# Altium project AnalogECG.PrjPcb
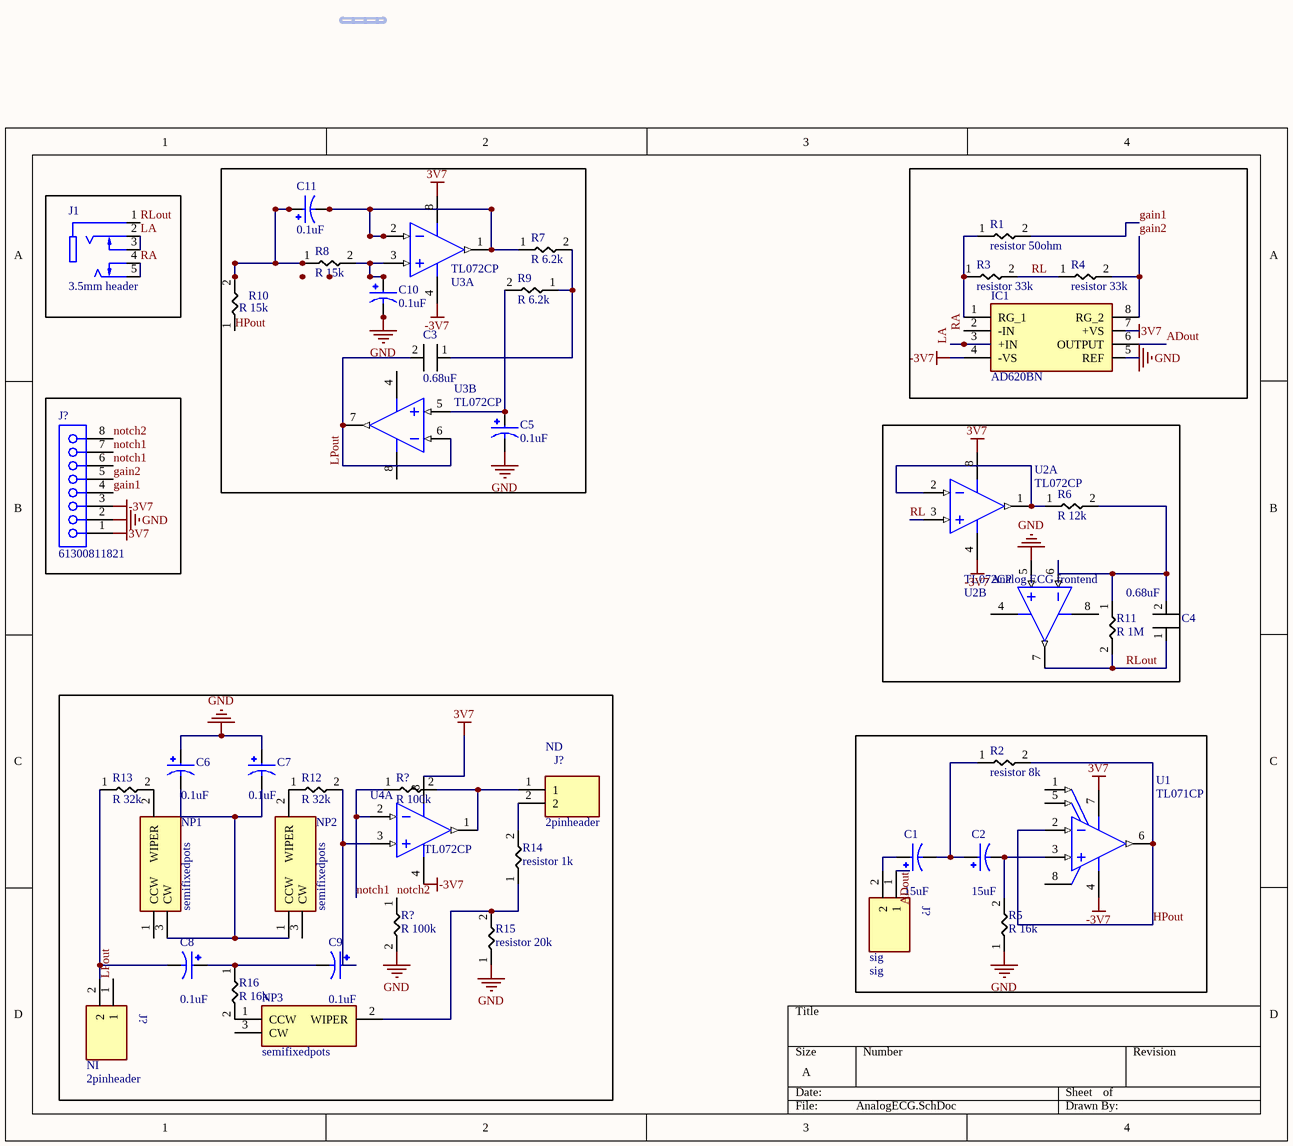
[diagram p0: AnalogECG.SchDoc]
1 sheet, 42 parts. Net scope: global (net labels, ports and power ports of the same name join across sheets).
Board file: analog_ECG_PCB_v1.PcbDoc

## Sheet AnalogECG.SchDoc
size A; SheetNumber: 1; SheetTotal: 1

### Parts
(Parts that share a designator on the sheet are numbered #1, #2 ... from top to bottom, then left to right.)
C1  value 15uF  [Capacitor10uF]  (hidden comment: capacitor 15uF)
C2  value 15uF  [Capacitor10uF]  (hidden comment: capacitor 15uF)
C3  0.68uF  [Capacitor - duplicate]
C4  0.68uF  [Capacitor - duplicate]
C5  value 0.1uF  [Capacitor10uF]  (hidden comment: capacitor 0.1uF)
C6  0.1uF  [Capacitor10uF]
C7  0.1uF  [Capacitor10uF]
C8  value 0.1uF  [Capacitor10uF]  (hidden comment: capacitor 0.1uF)
C9  value 0.1uF  [Capacitor10uF]  (hidden comment: capacitor 0.1uF)
C10  0.1uF  [Capacitor10uF]
C11  0.1uF  [Capacitor10uF]
IC1  AD620BN  [DIP794W56P254L959H533Q8N]
J1  3.5mm header  [SWITCHCRAFT_35RAPC4BH3]
J?  61300811821  [61300811821]
ND  2pinheader  [HDRV2W66P0X254_1X2_508X254X874P]
NI  2pinheader  [HDRV2W66P0X254_1X2_508X254X874P]
NP1  semifixedpots  [VRRM065]
NP2  semifixedpots  [VRRM065]
NP3  semifixedpots  [VRRM065]
R1  resistor 50ohm  [Axial 0.4]
R2  resistor 8k  [Axial 0.4]
R3  resistor 33k  [Axial 0.4]
R4  resistor 33k  [Axial 0.4]
R5  R 16k  [Axial 0.4]
R6  R 12k  [Axial 0.4]
R7  R 6.2k  [Axial 0.4]
R8  R 15k  [Axial 0.4]
R9  R 6.2k  [Axial 0.4]
R10  R 15k  [Axial 0.4]
R11  R 1M  [Axial 0.4]
R12  R 32k  [Axial 0.4]
R13  R 32k  [Axial 0.4]
R14  resistor 1k  [Axial 0.4]
R15  resistor 20k  [Axial 0.4]
R16  R 16k  [Axial 0.4]
R?#1  R 100k  [Axial 0.4]
R?#2  R 100k  [Axial 0.4]
sig  sig  [HDRV2W66P0X254_1X2_508X254X874P]
U1  TL071CP  [P0008A]
U2  TL072CP  [P0008A]  (parts A,B of 2)
U3  TL072CP  [P0008A]  (parts A,B of 2)
U4  TL072CP  [P0008A]  (part A of 2)

### Blocks framed on the sheet
Analog ECG frontend: C4 R6 R11 U2

### Nets
3V7: IC1.7(+VS) J?.1 U1.7(VCC+) U2.8(VCC+) U3.8(VCC+) U4.8(VCC+)
-3V7: IC1.4(-VS) J?.3 U1.4(VCC-) U2.4(VCC-) U3.4(VCC-) U4.4(VCC-)
GND: C5.N C6.P C7.P C10.N IC1.5(REF) J?.2 R5.1 R15.1 R?#2.2 U2.5(IN2+)
ADout: IC1.6(OUTPUT) sig.1
gain1: J?.4 R1.2
gain2: IC1.8(RG_2) J?.5 R4.2
HPout: R2.2 R10.1 U1.2(IN-) U1.6(OUT)
LA: IC1.3(+IN) J1.2 J1.3
LPout: C3.2 NI.1 U3.6(IN2-) U3.7(OUT2)
notch1: J?.6 J?.7 R?#1.1 U4.2(IN1-)
notch2: J?.8 R?#2.1
RA: IC1.2(-IN) J1.4 J1.5
RL: R3.2 R4.1 U2.3(IN1+)
RLout: C4.1 J1.1 R11.2 U2.7(OUT2)
NetC1_N: C1.N C2.P R2.1
NetC1_P: C1.P sig.2
NetC2_N: C2.N R5.2 U1.3(IN+)
NetC3_1: C3.1 R7.2 R9.1
NetC4_2: C4.2 R6.2 R11.1 U2.6(IN2-)
NetC5_P: C5.P R9.2 U3.5(IN2+)
NetC6_N: C6.N C7.N NP1.3(CW) NP2.1(CCW)
NetC8_N: C8.N NI.2 R13.1
NetC8_P: C8.P C9.N R16.1
NetC9_P: C9.P R12.2 U4.3(IN1+)
NetC10_P: C10.P R8.2 U3.3(IN1+)
NetC11_N: C11.N R7.1 U3.1(OUT1) U3.2(IN1-)
NetC11_P: C11.P R8.1 R10.2
NetIC1_1: IC1.1(RG_1) R1.1 R3.1
NetND_1: ND.1 R?#1.2 U4.1(OUT1)
NetND_2: ND.2 R14.2
NetNP1_2: NP1.2(WIPER) R13.2
NetNP2_2: NP2.2(WIPER) R12.1
NetNP3_1: NP3.1(CCW) R16.2
NetNP3_2: NP3.2(WIPER) R14.1 R15.2
NetR6_1: R6.1 U2.1(OUT1) U2.2(IN1-)

Not connected (* = marked no-connect by the designer): NP1 1(CCW); NP2 3(CW); NP3 3(CW); U1 1(OFFSET_N1) 5(OFFSET_N2) 8(NC)

### Notes on the sheet
- (in symbol 2pinheader) J?

### Library data of the parts
C1 C2 = ECA-1HM100I (2): Aluminum Electrolytic Capacitor, Polarized, Aluminum (wet), 50V, 20% +Tol, 20% -Tol, 10uF, Through Hole Mount; Manufacturer: Panasonic; Dielectric Material: Aluminium; Leakage Current: 5uA; Ripple Current: 65mA; Tan Delta: 0.12; Supplier: Mouser; Supplier Part Number: 667-ECA-1HM100I; Manufacturer Part Number: ECA-1HM100I; RoHS: Yes; Category: Aluminum Electrolytic Capacitors; Stock: 35307; Pricing: 1=0.28, 10=0.193, 50=0.116, 100=0.098, 400=0.06, 1000=0.06, 2000=0.056, 4000=0.051, 8000=0.048, 10000=0.048 (USD); Mounting Technology: Through Hole; Pins: 2; Package Shape: Cylindrical; Terminal Finish: Tin; Min Operating Temperature: -40°C; Max Operating Temperature: 85°C; JESD-609 Code: e3; Package Style: RadialMeter; Packaging: Tape and Reel; Termination: Wire; Polarity: Polarized; Capacitor Type: Aluminium; Tolerance  (fill in as +-): 20%; Tolerance (fill in as +-): 20%; Rated DC Voltage (URdc): 50V; Diameter: 5mm; Length: 11mm; Terminal Pitch: 2.5mm; Reach SVHC Compliant: Yes; RoHS Compliant: Yes; ComponentLink1URL: https://datasheet.ciiva.com:443/pdfs/VipMasterIC/IC/PANA/PANA-S-A0009891632/PANA-S-A0009891632-1.pdf?src-supplier=IHS+Markit; ComponentLink1Description: https://datasheet.ciiva.com:443/pdfs/VipMasterIC/IC/PANA/PANA-S-A0009891632/PANA-S-A0009891632-1.pdf?src-supplier=IHS+Markit; ComponentLink2URL: https://datasheet.ciiva.com/14608/70067785-14608821.pdf?src-supplier=Allied+Electronics; ComponentLink2Description: https://datasheet.ciiva.com/14608/70067785-14608821.pdf?src-supplier=Allied+Electronics; ComponentLink3URL: https://datasheet.ciiva.com/15197/getdatasheetpartid-238364-15197946.pdf?src-supplier=Verical; ComponentLink3Description: https://datasheet.ciiva.com/15197/getdatasheetpartid-238364-15197946.pdf?src-supplier=Verical; ComponentLink4URL: https://datasheet.ciiva.com/7794/1907780-7794379.pdf?src-supplier=Element14; ComponentLink4Description: https://datasheet.ciiva.com/7794/1907780-7794379.pdf?src-supplier=Element14; ComponentLink5URL: https://datasheet.ciiva.com/2984/aba0000ce12-2984335.pdf?src-supplier=Avnet; ComponentLink5Description: https://datasheet.ciiva.com/2984/aba0000ce12-2984335.pdf?src-supplier=Avnet; ComponentLink6URL: https://datasheet.ciiva.com/6121/aba0000ce12-6121535.pdf?src-supplier=Farnell; ComponentLink6Description: https://datasheet.ciiva.com/6121/aba0000ce12-6121535.pdf?src-supplier=Farnell; ComponentLink7URL: https://datasheet.ciiva.com/28677/aba0000ce12-28677830.pdf?src-supplier=Element14; ComponentLink7Description: https://datasheet.ciiva.com/28677/aba0000ce12-28677830.pdf?src-supplier=Element14; ComponentLink8URL: https://datasheet.ciiva.com/24234/aba0000ce12-465472-24234949.pdf?src-supplier=Mouser; ComponentLink8Description: https://datasheet.ciiva.com/24234/aba0000ce12-465472-24234949.pdf?src-supplier=Mouser
C3 C4 = DE21XSA220KN3AX02F: Ceramic Capacitor, Ceramic, 10% +Tol, 10% -Tol, SL, -1000/+350ppm/Cel TC, 0.000022uF, Through Hole Mount; Manufacturer: Murata; Supplier: Mouser; Supplier Part Number: 81-DE21XSA220KN3AX2F; Manufacturer Part Number: DE21XSA220KN3AX02F; RoHS: Yes; Category: Ceramic Capacitors; Stock: 156; Pricing: 1=0.38, 10=0.252, 50=0.252, 100=0.151, 1000=0.095, 10000=0.09 (USD)
C5-C11 = ECA-1HM100I (2)_1: Aluminum Electrolytic Capacitor, Polarized, Aluminum (wet), 50V, 20% +Tol, 20% -Tol, 10uF, Through Hole Mount; Manufacturer: Panasonic; Dielectric Material: Aluminium; Leakage Current: 5uA; Ripple Current: 65mA; Tan Delta: 0.12; Supplier: Mouser; Supplier Part Number: 667-ECA-1HM100I; Manufacturer Part Number: ECA-1HM100I; RoHS: Yes; Category: Aluminum Electrolytic Capacitors; Stock: 35307; Pricing: 1=0.28, 10=0.193, 50=0.116, 100=0.098, 400=0.06, 1000=0.06, 2000=0.056, 4000=0.051, 8000=0.048, 10000=0.048 (USD); Mounting Technology: Through Hole; Pins: 2; Package Shape: Cylindrical; Terminal Finish: Tin; Min Operating Temperature: -40°C; Max Operating Temperature: 85°C; JESD-609 Code: e3; Package Style: RadialMeter; Packaging: Tape and Reel; Termination: Wire; Polarity: Polarized; Capacitor Type: Aluminium; Tolerance  (fill in as +-): 20%; Tolerance (fill in as +-): 20%; Rated DC Voltage (URdc): 50V; Diameter: 5mm; Length: 11mm; Terminal Pitch: 2.5mm; Reach SVHC Compliant: Yes; RoHS Compliant: Yes; ComponentLink1URL: https://datasheet.ciiva.com:443/pdfs/VipMasterIC/IC/PANA/PANA-S-A0009891632/PANA-S-A0009891632-1.pdf?src-supplier=IHS+Markit; ComponentLink1Description: https://datasheet.ciiva.com:443/pdfs/VipMasterIC/IC/PANA/PANA-S-A0009891632/PANA-S-A0009891632-1.pdf?src-supplier=IHS+Markit; ComponentLink2URL: https://datasheet.ciiva.com/14608/70067785-14608821.pdf?src-supplier=Allied+Electronics; ComponentLink2Description: https://datasheet.ciiva.com/14608/70067785-14608821.pdf?src-supplier=Allied+Electronics; ComponentLink3URL: https://datasheet.ciiva.com/15197/getdatasheetpartid-238364-15197946.pdf?src-supplier=Verical; ComponentLink3Description: https://datasheet.ciiva.com/15197/getdatasheetpartid-238364-15197946.pdf?src-supplier=Verical; ComponentLink4URL: https://datasheet.ciiva.com/7794/1907780-7794379.pdf?src-supplier=Element14; ComponentLink4Description: https://datasheet.ciiva.com/7794/1907780-7794379.pdf?src-supplier=Element14; ComponentLink5URL: https://datasheet.ciiva.com/2984/aba0000ce12-2984335.pdf?src-supplier=Avnet; ComponentLink5Description: https://datasheet.ciiva.com/2984/aba0000ce12-2984335.pdf?src-supplier=Avnet; ComponentLink6URL: https://datasheet.ciiva.com/6121/aba0000ce12-6121535.pdf?src-supplier=Farnell; ComponentLink6Description: https://datasheet.ciiva.com/6121/aba0000ce12-6121535.pdf?src-supplier=Farnell; ComponentLink7URL: https://datasheet.ciiva.com/28677/aba0000ce12-28677830.pdf?src-supplier=Element14; ComponentLink7Description: https://datasheet.ciiva.com/28677/aba0000ce12-28677830.pdf?src-supplier=Element14; ComponentLink8URL: https://datasheet.ciiva.com/24234/aba0000ce12-465472-24234949.pdf?src-supplier=Mouser; ComponentLink8Description: https://datasheet.ciiva.com/24234/aba0000ce12-465472-24234949.pdf?src-supplier=Mouser
  C6 C7 C10 C11: Value: 0.1uF
IC1 = AD620BN: Integrated Circuit; Manufacturer_Name: Rochester Electronics; Datasheet Link: https://www.analog.com/media/en/technical-documentation/data-sheets/ad620.pdf; Height: 5.33mm; Manufacturer_Part_Number: AD620BN
J1 = 35RAPC4BH3: 3.50mm (0.141", 1/8", Mini Plug) - Headphone Phone Jack Stereo (3 Conductor, TRS) Connector Solder; Package: None; Price: None; Value: *; MP: 35RAPC4BH3; Availability: Unavailable
J? = CMP-1502-01327-2: NexarPartId: 61924723; Contact Resistance: 20mΩ; Current Rating: 3A; Operating Supply Voltage: 250V; Gender: Female; Number of Pins: 8; Orientation: Vertical; Lead Pitch: 2.54mm; RoHS: Non-Compliant
R1 = CF14JT10K0_1: Fixed Resistor, Carbon Film, 0.25W, 10000ohm, 350V, 5% +/-Tol, -500,0ppm/Cel, Through Hole Mount; Manufacturer: Stackpole Electronics; Power: 250mW; Rated Temperature: 70°C; Value: 10kR; Temperature Coefficient: 500ppm/°C; Lead Diameter: 0.55mm; Lead Length: 28mm; Package Diameter: 2.3mm; Package Length: 6mm; Supplier: Digi-Key; Supplier Part Number: CF14JT10K0TR-ND; Manufacturer Part Number: CF14JT10K0; RoHS: Yes; Category: Through-Hole Resistors; Pricing: 5000=0.00729, 10000=0.00633, 25000=0.00557, 50000=0.0051, 125000=0.005 (USD); Mounting Technology: Through Hole; Pins: 2; Package Shape: Tubular; Terminal Finish: Tin; Min Operating Temperature: -55°C; Max Operating Temperature: 155°C; Tolerance: 5%; Resistor Type: FIXED RESISTOR; Construction: Tubular; Package Style: AxialMeter; Packaging: Tape and Reel; Technology: CARBON FILM; Termination: Wire; Working Voltage: 350V; JESD-609 Code: e3; Reach SVHC Compliant: Yes; RoHS Compliant: Yes; ComponentLink1URL: https://datasheet.ciiva.com:443/pdfs/VipMasterIC/IC/SEIE/SEIE-S-A0009883960/SEIE-S-A0009883960-1.pdf?src-supplier=IHS+Markit; ComponentLink1Description: https://datasheet.ciiva.com:443/pdfs/VipMasterIC/IC/SEIE/SEIE-S-A0009883960/SEIE-S-A0009883960-1.pdf?src-supplier=IHS+Markit; ComponentLink2URL: http://components.arrow.com/part/dataview/27619991S9848636N1174?src-supplier=Arrow+Electronics; ComponentLink2Description: http://components.arrow.com/part/dataview/27619991S9848636N1174?src-supplier=Arrow+Electronics; ComponentLink3URL: https://www.seielect.com/catalog/SEI-CF_CFM.pdf?src-supplier=Avnet; ComponentLink3Description: https://www.seielect.com/catalog/SEI-CF_CFM.pdf?src-supplier=Avnet; ComponentLink4URL: https://www.seielect.com/catalog/SEI-Packaging.pdf?src-supplier=Digi-Key; ComponentLink4Description: https://www.seielect.com/catalog/SEI-Packaging.pdf?src-supplier=Digi-Key; ComponentLink5URL: https://www.verical.com/server-webapp/html/getDatasheet?partID=367360&src-supplier=Verical; ComponentLink5Description: https://www.verical.com/server-webapp/html/getDatasheet?partID=367360&src-supplier=Verical; ComponentLink6URL: http://www.seielect.com/Catalog/SEI-CF_CFM.pdf?src-supplier=Future+Electronics; ComponentLink6Description: http://www.seielect.com/Catalog/SEI-CF_CFM.pdf?src-supplier=Future+Electronics
R2 = CF14JT10K01208: Fixed Resistor, Carbon Film, 0.25W, 10000ohm, 350V, 5% +/-Tol, -500,0ppm/Cel, Through Hole Mount; Manufacturer: Stackpole Electronics; Power: 250mW; Rated Temperature: 70°C; Value: 10kR; Temperature Coefficient: 500ppm/°C; Lead Diameter: 0.55mm; Lead Length: 28mm; Package Diameter: 2.3mm; Package Length: 6mm; Supplier: Digi-Key; Supplier Part Number: CF14JT10K0TR-ND; Manufacturer Part Number: CF14JT10K0; RoHS: Yes; Category: Through-Hole Resistors; Pricing: 5000=0.00729, 10000=0.00633, 25000=0.00557, 50000=0.0051, 125000=0.005 (USD); Mounting Technology: Through Hole; Pins: 2; Package Shape: Tubular; Terminal Finish: Tin; Min Operating Temperature: -55°C; Max Operating Temperature: 155°C; Tolerance: 5%; Resistor Type: FIXED RESISTOR; Construction: Tubular; Package Style: AxialMeter; Packaging: Tape and Reel; Technology: CARBON FILM; Termination: Wire; Working Voltage: 350V; JESD-609 Code: e3; Reach SVHC Compliant: Yes; RoHS Compliant: Yes; ComponentLink1URL: https://datasheet.ciiva.com:443/pdfs/VipMasterIC/IC/SEIE/SEIE-S-A0009883960/SEIE-S-A0009883960-1.pdf?src-supplier=IHS+Markit; ComponentLink1Description: https://datasheet.ciiva.com:443/pdfs/VipMasterIC/IC/SEIE/SEIE-S-A0009883960/SEIE-S-A0009883960-1.pdf?src-supplier=IHS+Markit; ComponentLink2URL: http://components.arrow.com/part/dataview/27619991S9848636N1174?src-supplier=Arrow+Electronics; ComponentLink2Description: http://components.arrow.com/part/dataview/27619991S9848636N1174?src-supplier=Arrow+Electronics; ComponentLink3URL: https://www.seielect.com/catalog/SEI-CF_CFM.pdf?src-supplier=Avnet; ComponentLink3Description: https://www.seielect.com/catalog/SEI-CF_CFM.pdf?src-supplier=Avnet; ComponentLink4URL: https://www.seielect.com/catalog/SEI-Packaging.pdf?src-supplier=Digi-Key; ComponentLink4Description: https://www.seielect.com/catalog/SEI-Packaging.pdf?src-supplier=Digi-Key; ComponentLink5URL: https://www.verical.com/server-webapp/html/getDatasheet?partID=367360&src-supplier=Verical; ComponentLink5Description: https://www.verical.com/server-webapp/html/getDatasheet?partID=367360&src-supplier=Verical; ComponentLink6URL: http://www.seielect.com/Catalog/SEI-CF_CFM.pdf?src-supplier=Future+Electronics; ComponentLink6Description: http://www.seielect.com/Catalog/SEI-CF_CFM.pdf?src-supplier=Future+Electronics
R3 R4 = CF14JT10K0: Fixed Resistor, Carbon Film, 0.25W, 10000ohm, 350V, 5% +/-Tol, -500,0ppm/Cel, Through Hole Mount; Manufacturer: Stackpole Electronics; Power: 250mW; Rated Temperature: 70°C; Value: 10kR; Temperature Coefficient: 500ppm/°C; Lead Diameter: 0.55mm; Lead Length: 28mm; Package Diameter: 2.3mm; Package Length: 6mm; Supplier: Digi-Key; Supplier Part Number: CF14JT10K0TR-ND; Manufacturer Part Number: CF14JT10K0; RoHS: Yes; Category: Through-Hole Resistors; Pricing: 5000=0.00729, 10000=0.00633, 25000=0.00557, 50000=0.0051, 125000=0.005 (USD); Mounting Technology: Through Hole; Pins: 2; Package Shape: Tubular; Terminal Finish: Tin; Min Operating Temperature: -55°C; Max Operating Temperature: 155°C; Tolerance: 5%; Resistor Type: FIXED RESISTOR; Construction: Tubular; Package Style: AxialMeter; Packaging: Tape and Reel; Technology: CARBON FILM; Termination: Wire; Working Voltage: 350V; JESD-609 Code: e3; Reach SVHC Compliant: Yes; RoHS Compliant: Yes; ComponentLink1URL: https://datasheet.ciiva.com:443/pdfs/VipMasterIC/IC/SEIE/SEIE-S-A0009883960/SEIE-S-A0009883960-1.pdf?src-supplier=IHS+Markit; ComponentLink1Description: https://datasheet.ciiva.com:443/pdfs/VipMasterIC/IC/SEIE/SEIE-S-A0009883960/SEIE-S-A0009883960-1.pdf?src-supplier=IHS+Markit; ComponentLink2URL: http://components.arrow.com/part/dataview/27619991S9848636N1174?src-supplier=Arrow+Electronics; ComponentLink2Description: http://components.arrow.com/part/dataview/27619991S9848636N1174?src-supplier=Arrow+Electronics; ComponentLink3URL: https://www.seielect.com/catalog/SEI-CF_CFM.pdf?src-supplier=Avnet; ComponentLink3Description: https://www.seielect.com/catalog/SEI-CF_CFM.pdf?src-supplier=Avnet; ComponentLink4URL: https://www.seielect.com/catalog/SEI-Packaging.pdf?src-supplier=Digi-Key; ComponentLink4Description: https://www.seielect.com/catalog/SEI-Packaging.pdf?src-supplier=Digi-Key; ComponentLink5URL: https://www.verical.com/server-webapp/html/getDatasheet?partID=367360&src-supplier=Verical; ComponentLink5Description: https://www.verical.com/server-webapp/html/getDatasheet?partID=367360&src-supplier=Verical; ComponentLink6URL: http://www.seielect.com/Catalog/SEI-CF_CFM.pdf?src-supplier=Future+Electronics; ComponentLink6Description: http://www.seielect.com/Catalog/SEI-CF_CFM.pdf?src-supplier=Future+Electronics
R5 R16 = CF14JT10K016: Fixed Resistor, Carbon Film, 0.25W, 10000ohm, 350V, 5% +/-Tol, -500,0ppm/Cel, Through Hole Mount; Manufacturer: Stackpole Electronics; Power: 250mW; Rated Temperature: 70°C; Value: 10kR; Temperature Coefficient: 500ppm/°C; Lead Diameter: 0.55mm; Lead Length: 28mm; Package Diameter: 2.3mm; Package Length: 6mm; Supplier: Digi-Key; Supplier Part Number: CF14JT10K0TR-ND; Manufacturer Part Number: CF14JT10K0; RoHS: Yes; Category: Through-Hole Resistors; Pricing: 5000=0.00729, 10000=0.00633, 25000=0.00557, 50000=0.0051, 125000=0.005 (USD); Mounting Technology: Through Hole; Pins: 2; Package Shape: Tubular; Terminal Finish: Tin; Min Operating Temperature: -55°C; Max Operating Temperature: 155°C; Tolerance: 5%; Resistor Type: FIXED RESISTOR; Construction: Tubular; Package Style: AxialMeter; Packaging: Tape and Reel; Technology: CARBON FILM; Termination: Wire; Working Voltage: 350V; JESD-609 Code: e3; Reach SVHC Compliant: Yes; RoHS Compliant: Yes; ComponentLink1URL: https://datasheet.ciiva.com:443/pdfs/VipMasterIC/IC/SEIE/SEIE-S-A0009883960/SEIE-S-A0009883960-1.pdf?src-supplier=IHS+Markit; ComponentLink1Description: https://datasheet.ciiva.com:443/pdfs/VipMasterIC/IC/SEIE/SEIE-S-A0009883960/SEIE-S-A0009883960-1.pdf?src-supplier=IHS+Markit; ComponentLink2URL: http://components.arrow.com/part/dataview/27619991S9848636N1174?src-supplier=Arrow+Electronics; ComponentLink2Description: http://components.arrow.com/part/dataview/27619991S9848636N1174?src-supplier=Arrow+Electronics; ComponentLink3URL: https://www.seielect.com/catalog/SEI-CF_CFM.pdf?src-supplier=Avnet; ComponentLink3Description: https://www.seielect.com/catalog/SEI-CF_CFM.pdf?src-supplier=Avnet; ComponentLink4URL: https://www.seielect.com/catalog/SEI-Packaging.pdf?src-supplier=Digi-Key; ComponentLink4Description: https://www.seielect.com/catalog/SEI-Packaging.pdf?src-supplier=Digi-Key; ComponentLink5URL: https://www.verical.com/server-webapp/html/getDatasheet?partID=367360&src-supplier=Verical; ComponentLink5Description: https://www.verical.com/server-webapp/html/getDatasheet?partID=367360&src-supplier=Verical; ComponentLink6URL: http://www.seielect.com/Catalog/SEI-CF_CFM.pdf?src-supplier=Future+Electronics; ComponentLink6Description: http://www.seielect.com/Catalog/SEI-CF_CFM.pdf?src-supplier=Future+Electronics
R6 = CF14JT10K0_1_1: Fixed Resistor, Carbon Film, 0.25W, 10000ohm, 350V, 5% +/-Tol, -500,0ppm/Cel, Through Hole Mount; Manufacturer: Stackpole Electronics; Power: 250mW; Rated Temperature: 70°C; Value: 10kR; Temperature Coefficient: 500ppm/°C; Lead Diameter: 0.55mm; Lead Length: 28mm; Package Diameter: 2.3mm; Package Length: 6mm; Supplier: Digi-Key; Supplier Part Number: CF14JT10K0TR-ND; Manufacturer Part Number: CF14JT10K0; RoHS: Yes; Category: Through-Hole Resistors; Pricing: 5000=0.00729, 10000=0.00633, 25000=0.00557, 50000=0.0051, 125000=0.005 (USD); Mounting Technology: Through Hole; Pins: 2; Package Shape: Tubular; Terminal Finish: Tin; Min Operating Temperature: -55°C; Max Operating Temperature: 155°C; Tolerance: 5%; Resistor Type: FIXED RESISTOR; Construction: Tubular; Package Style: AxialMeter; Packaging: Tape and Reel; Technology: CARBON FILM; Termination: Wire; Working Voltage: 350V; JESD-609 Code: e3; Reach SVHC Compliant: Yes; RoHS Compliant: Yes; ComponentLink1URL: https://datasheet.ciiva.com:443/pdfs/VipMasterIC/IC/SEIE/SEIE-S-A0009883960/SEIE-S-A0009883960-1.pdf?src-supplier=IHS+Markit; ComponentLink1Description: https://datasheet.ciiva.com:443/pdfs/VipMasterIC/IC/SEIE/SEIE-S-A0009883960/SEIE-S-A0009883960-1.pdf?src-supplier=IHS+Markit; ComponentLink2URL: http://components.arrow.com/part/dataview/27619991S9848636N1174?src-supplier=Arrow+Electronics; ComponentLink2Description: http://components.arrow.com/part/dataview/27619991S9848636N1174?src-supplier=Arrow+Electronics; ComponentLink3URL: https://www.seielect.com/catalog/SEI-CF_CFM.pdf?src-supplier=Avnet; ComponentLink3Description: https://www.seielect.com/catalog/SEI-CF_CFM.pdf?src-supplier=Avnet; ComponentLink4URL: https://www.seielect.com/catalog/SEI-Packaging.pdf?src-supplier=Digi-Key; ComponentLink4Description: https://www.seielect.com/catalog/SEI-Packaging.pdf?src-supplier=Digi-Key; ComponentLink5URL: https://www.verical.com/server-webapp/html/getDatasheet?partID=367360&src-supplier=Verical; ComponentLink5Description: https://www.verical.com/server-webapp/html/getDatasheet?partID=367360&src-supplier=Verical; ComponentLink6URL: http://www.seielect.com/Catalog/SEI-CF_CFM.pdf?src-supplier=Future+Electronics; ComponentLink6Description: http://www.seielect.com/Catalog/SEI-CF_CFM.pdf?src-supplier=Future+Electronics
R7 R9 = CF14JT10K0_1_1_1_1: Fixed Resistor, Carbon Film, 0.25W, 10000ohm, 350V, 5% +/-Tol, -500,0ppm/Cel, Through Hole Mount; Manufacturer: Stackpole Electronics; Power: 250mW; Rated Temperature: 70°C; Value: 10kR; Temperature Coefficient: 500ppm/°C; Lead Diameter: 0.55mm; Lead Length: 28mm; Package Diameter: 2.3mm; Package Length: 6mm; Supplier: Digi-Key; Supplier Part Number: CF14JT10K0TR-ND; Manufacturer Part Number: CF14JT10K0; RoHS: Yes; Category: Through-Hole Resistors; Pricing: 5000=0.00729, 10000=0.00633, 25000=0.00557, 50000=0.0051, 125000=0.005 (USD); Mounting Technology: Through Hole; Pins: 2; Package Shape: Tubular; Terminal Finish: Tin; Min Operating Temperature: -55°C; Max Operating Temperature: 155°C; Tolerance: 5%; Resistor Type: FIXED RESISTOR; Construction: Tubular; Package Style: AxialMeter; Packaging: Tape and Reel; Technology: CARBON FILM; Termination: Wire; Working Voltage: 350V; JESD-609 Code: e3; Reach SVHC Compliant: Yes; RoHS Compliant: Yes; ComponentLink1URL: https://datasheet.ciiva.com:443/pdfs/VipMasterIC/IC/SEIE/SEIE-S-A0009883960/SEIE-S-A0009883960-1.pdf?src-supplier=IHS+Markit; ComponentLink1Description: https://datasheet.ciiva.com:443/pdfs/VipMasterIC/IC/SEIE/SEIE-S-A0009883960/SEIE-S-A0009883960-1.pdf?src-supplier=IHS+Markit; ComponentLink2URL: http://components.arrow.com/part/dataview/27619991S9848636N1174?src-supplier=Arrow+Electronics; ComponentLink2Description: http://components.arrow.com/part/dataview/27619991S9848636N1174?src-supplier=Arrow+Electronics; ComponentLink3URL: https://www.seielect.com/catalog/SEI-CF_CFM.pdf?src-supplier=Avnet; ComponentLink3Description: https://www.seielect.com/catalog/SEI-CF_CFM.pdf?src-supplier=Avnet; ComponentLink4URL: https://www.seielect.com/catalog/SEI-Packaging.pdf?src-supplier=Digi-Key; ComponentLink4Description: https://www.seielect.com/catalog/SEI-Packaging.pdf?src-supplier=Digi-Key; ComponentLink5URL: https://www.verical.com/server-webapp/html/getDatasheet?partID=367360&src-supplier=Verical; ComponentLink5Description: https://www.verical.com/server-webapp/html/getDatasheet?partID=367360&src-supplier=Verical; ComponentLink6URL: http://www.seielect.com/Catalog/SEI-CF_CFM.pdf?src-supplier=Future+Electronics; ComponentLink6Description: http://www.seielect.com/Catalog/SEI-CF_CFM.pdf?src-supplier=Future+Electronics
R8 R10 = CF14JT10K0_1_1_1_1_1: Fixed Resistor, Carbon Film, 0.25W, 10000ohm, 350V, 5% +/-Tol, -500,0ppm/Cel, Through Hole Mount; Manufacturer: Stackpole Electronics; Power: 250mW; Rated Temperature: 70°C; Value: 10kR; Temperature Coefficient: 500ppm/°C; Lead Diameter: 0.55mm; Lead Length: 28mm; Package Diameter: 2.3mm; Package Length: 6mm; Supplier: Digi-Key; Supplier Part Number: CF14JT10K0TR-ND; Manufacturer Part Number: CF14JT10K0; RoHS: Yes; Category: Through-Hole Resistors; Pricing: 5000=0.00729, 10000=0.00633, 25000=0.00557, 50000=0.0051, 125000=0.005 (USD); Mounting Technology: Through Hole; Pins: 2; Package Shape: Tubular; Terminal Finish: Tin; Min Operating Temperature: -55°C; Max Operating Temperature: 155°C; Tolerance: 5%; Resistor Type: FIXED RESISTOR; Construction: Tubular; Package Style: AxialMeter; Packaging: Tape and Reel; Technology: CARBON FILM; Termination: Wire; Working Voltage: 350V; JESD-609 Code: e3; Reach SVHC Compliant: Yes; RoHS Compliant: Yes; ComponentLink1URL: https://datasheet.ciiva.com:443/pdfs/VipMasterIC/IC/SEIE/SEIE-S-A0009883960/SEIE-S-A0009883960-1.pdf?src-supplier=IHS+Markit; ComponentLink1Description: https://datasheet.ciiva.com:443/pdfs/VipMasterIC/IC/SEIE/SEIE-S-A0009883960/SEIE-S-A0009883960-1.pdf?src-supplier=IHS+Markit; ComponentLink2URL: http://components.arrow.com/part/dataview/27619991S9848636N1174?src-supplier=Arrow+Electronics; ComponentLink2Description: http://components.arrow.com/part/dataview/27619991S9848636N1174?src-supplier=Arrow+Electronics; ComponentLink3URL: https://www.seielect.com/catalog/SEI-CF_CFM.pdf?src-supplier=Avnet; ComponentLink3Description: https://www.seielect.com/catalog/SEI-CF_CFM.pdf?src-supplier=Avnet; ComponentLink4URL: https://www.seielect.com/catalog/SEI-Packaging.pdf?src-supplier=Digi-Key; ComponentLink4Description: https://www.seielect.com/catalog/SEI-Packaging.pdf?src-supplier=Digi-Key; ComponentLink5URL: https://www.verical.com/server-webapp/html/getDatasheet?partID=367360&src-supplier=Verical; ComponentLink5Description: https://www.verical.com/server-webapp/html/getDatasheet?partID=367360&src-supplier=Verical; ComponentLink6URL: http://www.seielect.com/Catalog/SEI-CF_CFM.pdf?src-supplier=Future+Electronics; ComponentLink6Description: http://www.seielect.com/Catalog/SEI-CF_CFM.pdf?src-supplier=Future+Electronics
R11 R?#1 R?#2 = CF14JT10K0_1_1_1: Fixed Resistor, Carbon Film, 0.25W, 10000ohm, 350V, 5% +/-Tol, -500,0ppm/Cel, Through Hole Mount; Manufacturer: Stackpole Electronics; Power: 250mW; Rated Temperature: 70°C; Value: 10kR; Temperature Coefficient: 500ppm/°C; Lead Diameter: 0.55mm; Lead Length: 28mm; Package Diameter: 2.3mm; Package Length: 6mm; Supplier: Digi-Key; Supplier Part Number: CF14JT10K0TR-ND; Manufacturer Part Number: CF14JT10K0; RoHS: Yes; Category: Through-Hole Resistors; Pricing: 5000=0.00729, 10000=0.00633, 25000=0.00557, 50000=0.0051, 125000=0.005 (USD); Mounting Technology: Through Hole; Pins: 2; Package Shape: Tubular; Terminal Finish: Tin; Min Operating Temperature: -55°C; Max Operating Temperature: 155°C; Tolerance: 5%; Resistor Type: FIXED RESISTOR; Construction: Tubular; Package Style: AxialMeter; Packaging: Tape and Reel; Technology: CARBON FILM; Termination: Wire; Working Voltage: 350V; JESD-609 Code: e3; Reach SVHC Compliant: Yes; RoHS Compliant: Yes; ComponentLink1URL: https://datasheet.ciiva.com:443/pdfs/VipMasterIC/IC/SEIE/SEIE-S-A0009883960/SEIE-S-A0009883960-1.pdf?src-supplier=IHS+Markit; ComponentLink1Description: https://datasheet.ciiva.com:443/pdfs/VipMasterIC/IC/SEIE/SEIE-S-A0009883960/SEIE-S-A0009883960-1.pdf?src-supplier=IHS+Markit; ComponentLink2URL: http://components.arrow.com/part/dataview/27619991S9848636N1174?src-supplier=Arrow+Electronics; ComponentLink2Description: http://components.arrow.com/part/dataview/27619991S9848636N1174?src-supplier=Arrow+Electronics; ComponentLink3URL: https://www.seielect.com/catalog/SEI-CF_CFM.pdf?src-supplier=Avnet; ComponentLink3Description: https://www.seielect.com/catalog/SEI-CF_CFM.pdf?src-supplier=Avnet; ComponentLink4URL: https://www.seielect.com/catalog/SEI-Packaging.pdf?src-supplier=Digi-Key; ComponentLink4Description: https://www.seielect.com/catalog/SEI-Packaging.pdf?src-supplier=Digi-Key; ComponentLink5URL: https://www.verical.com/server-webapp/html/getDatasheet?partID=367360&src-supplier=Verical; ComponentLink5Description: https://www.verical.com/server-webapp/html/getDatasheet?partID=367360&src-supplier=Verical; ComponentLink6URL: http://www.seielect.com/Catalog/SEI-CF_CFM.pdf?src-supplier=Future+Electronics; ComponentLink6Description: http://www.seielect.com/Catalog/SEI-CF_CFM.pdf?src-supplier=Future+Electronics
R12 R13 = CF14JT10K032: Fixed Resistor, Carbon Film, 0.25W, 10000ohm, 350V, 5% +/-Tol, -500,0ppm/Cel, Through Hole Mount; Manufacturer: Stackpole Electronics; Power: 250mW; Rated Temperature: 70°C; Value: 10kR; Temperature Coefficient: 500ppm/°C; Lead Diameter: 0.55mm; Lead Length: 28mm; Package Diameter: 2.3mm; Package Length: 6mm; Supplier: Digi-Key; Supplier Part Number: CF14JT10K0TR-ND; Manufacturer Part Number: CF14JT10K0; RoHS: Yes; Category: Through-Hole Resistors; Pricing: 5000=0.00729, 10000=0.00633, 25000=0.00557, 50000=0.0051, 125000=0.005 (USD); Mounting Technology: Through Hole; Pins: 2; Package Shape: Tubular; Terminal Finish: Tin; Min Operating Temperature: -55°C; Max Operating Temperature: 155°C; Tolerance: 5%; Resistor Type: FIXED RESISTOR; Construction: Tubular; Package Style: AxialMeter; Packaging: Tape and Reel; Technology: CARBON FILM; Termination: Wire; Working Voltage: 350V; JESD-609 Code: e3; Reach SVHC Compliant: Yes; RoHS Compliant: Yes; ComponentLink1URL: https://datasheet.ciiva.com:443/pdfs/VipMasterIC/IC/SEIE/SEIE-S-A0009883960/SEIE-S-A0009883960-1.pdf?src-supplier=IHS+Markit; ComponentLink1Description: https://datasheet.ciiva.com:443/pdfs/VipMasterIC/IC/SEIE/SEIE-S-A0009883960/SEIE-S-A0009883960-1.pdf?src-supplier=IHS+Markit; ComponentLink2URL: http://components.arrow.com/part/dataview/27619991S9848636N1174?src-supplier=Arrow+Electronics; ComponentLink2Description: http://components.arrow.com/part/dataview/27619991S9848636N1174?src-supplier=Arrow+Electronics; ComponentLink3URL: https://www.seielect.com/catalog/SEI-CF_CFM.pdf?src-supplier=Avnet; ComponentLink3Description: https://www.seielect.com/catalog/SEI-CF_CFM.pdf?src-supplier=Avnet; ComponentLink4URL: https://www.seielect.com/catalog/SEI-Packaging.pdf?src-supplier=Digi-Key; ComponentLink4Description: https://www.seielect.com/catalog/SEI-Packaging.pdf?src-supplier=Digi-Key; ComponentLink5URL: https://www.verical.com/server-webapp/html/getDatasheet?partID=367360&src-supplier=Verical; ComponentLink5Description: https://www.verical.com/server-webapp/html/getDatasheet?partID=367360&src-supplier=Verical; ComponentLink6URL: http://www.seielect.com/Catalog/SEI-CF_CFM.pdf?src-supplier=Future+Electronics; ComponentLink6Description: http://www.seielect.com/Catalog/SEI-CF_CFM.pdf?src-supplier=Future+Electronics
R14 = CF14JT10K01: Fixed Resistor, Carbon Film, 0.25W, 10000ohm, 350V, 5% +/-Tol, -500,0ppm/Cel, Through Hole Mount; Manufacturer: Stackpole Electronics; Power: 250mW; Rated Temperature: 70°C; Value: 10kR; Temperature Coefficient: 500ppm/°C; Lead Diameter: 0.55mm; Lead Length: 28mm; Package Diameter: 2.3mm; Package Length: 6mm; Supplier: Digi-Key; Supplier Part Number: CF14JT10K0TR-ND; Manufacturer Part Number: CF14JT10K0; RoHS: Yes; Category: Through-Hole Resistors; Pricing: 5000=0.00729, 10000=0.00633, 25000=0.00557, 50000=0.0051, 125000=0.005 (USD); Mounting Technology: Through Hole; Pins: 2; Package Shape: Tubular; Terminal Finish: Tin; Min Operating Temperature: -55°C; Max Operating Temperature: 155°C; Tolerance: 5%; Resistor Type: FIXED RESISTOR; Construction: Tubular; Package Style: AxialMeter; Packaging: Tape and Reel; Technology: CARBON FILM; Termination: Wire; Working Voltage: 350V; JESD-609 Code: e3; Reach SVHC Compliant: Yes; RoHS Compliant: Yes; ComponentLink1URL: https://datasheet.ciiva.com:443/pdfs/VipMasterIC/IC/SEIE/SEIE-S-A0009883960/SEIE-S-A0009883960-1.pdf?src-supplier=IHS+Markit; ComponentLink1Description: https://datasheet.ciiva.com:443/pdfs/VipMasterIC/IC/SEIE/SEIE-S-A0009883960/SEIE-S-A0009883960-1.pdf?src-supplier=IHS+Markit; ComponentLink2URL: http://components.arrow.com/part/dataview/27619991S9848636N1174?src-supplier=Arrow+Electronics; ComponentLink2Description: http://components.arrow.com/part/dataview/27619991S9848636N1174?src-supplier=Arrow+Electronics; ComponentLink3URL: https://www.seielect.com/catalog/SEI-CF_CFM.pdf?src-supplier=Avnet; ComponentLink3Description: https://www.seielect.com/catalog/SEI-CF_CFM.pdf?src-supplier=Avnet; ComponentLink4URL: https://www.seielect.com/catalog/SEI-Packaging.pdf?src-supplier=Digi-Key; ComponentLink4Description: https://www.seielect.com/catalog/SEI-Packaging.pdf?src-supplier=Digi-Key; ComponentLink5URL: https://www.verical.com/server-webapp/html/getDatasheet?partID=367360&src-supplier=Verical; ComponentLink5Description: https://www.verical.com/server-webapp/html/getDatasheet?partID=367360&src-supplier=Verical; ComponentLink6URL: http://www.seielect.com/Catalog/SEI-CF_CFM.pdf?src-supplier=Future+Electronics; ComponentLink6Description: http://www.seielect.com/Catalog/SEI-CF_CFM.pdf?src-supplier=Future+Electronics
R15 = CF14JT10K0120: Fixed Resistor, Carbon Film, 0.25W, 10000ohm, 350V, 5% +/-Tol, -500,0ppm/Cel, Through Hole Mount; Manufacturer: Stackpole Electronics; Power: 250mW; Rated Temperature: 70°C; Value: 10kR; Temperature Coefficient: 500ppm/°C; Lead Diameter: 0.55mm; Lead Length: 28mm; Package Diameter: 2.3mm; Package Length: 6mm; Supplier: Digi-Key; Supplier Part Number: CF14JT10K0TR-ND; Manufacturer Part Number: CF14JT10K0; RoHS: Yes; Category: Through-Hole Resistors; Pricing: 5000=0.00729, 10000=0.00633, 25000=0.00557, 50000=0.0051, 125000=0.005 (USD); Mounting Technology: Through Hole; Pins: 2; Package Shape: Tubular; Terminal Finish: Tin; Min Operating Temperature: -55°C; Max Operating Temperature: 155°C; Tolerance: 5%; Resistor Type: FIXED RESISTOR; Construction: Tubular; Package Style: AxialMeter; Packaging: Tape and Reel; Technology: CARBON FILM; Termination: Wire; Working Voltage: 350V; JESD-609 Code: e3; Reach SVHC Compliant: Yes; RoHS Compliant: Yes; ComponentLink1URL: https://datasheet.ciiva.com:443/pdfs/VipMasterIC/IC/SEIE/SEIE-S-A0009883960/SEIE-S-A0009883960-1.pdf?src-supplier=IHS+Markit; ComponentLink1Description: https://datasheet.ciiva.com:443/pdfs/VipMasterIC/IC/SEIE/SEIE-S-A0009883960/SEIE-S-A0009883960-1.pdf?src-supplier=IHS+Markit; ComponentLink2URL: http://components.arrow.com/part/dataview/27619991S9848636N1174?src-supplier=Arrow+Electronics; ComponentLink2Description: http://components.arrow.com/part/dataview/27619991S9848636N1174?src-supplier=Arrow+Electronics; ComponentLink3URL: https://www.seielect.com/catalog/SEI-CF_CFM.pdf?src-supplier=Avnet; ComponentLink3Description: https://www.seielect.com/catalog/SEI-CF_CFM.pdf?src-supplier=Avnet; ComponentLink4URL: https://www.seielect.com/catalog/SEI-Packaging.pdf?src-supplier=Digi-Key; ComponentLink4Description: https://www.seielect.com/catalog/SEI-Packaging.pdf?src-supplier=Digi-Key; ComponentLink5URL: https://www.verical.com/server-webapp/html/getDatasheet?partID=367360&src-supplier=Verical; ComponentLink5Description: https://www.verical.com/server-webapp/html/getDatasheet?partID=367360&src-supplier=Verical; ComponentLink6URL: http://www.seielect.com/Catalog/SEI-CF_CFM.pdf?src-supplier=Future+Electronics; ComponentLink6Description: http://www.seielect.com/Catalog/SEI-CF_CFM.pdf?src-supplier=Future+Electronics
sig = 2pinheader
U1 = CMP-0017-00972-2: Low-Noise JFET-Input General-Purpose Operational Amplifier, 7 to 36 V, 0 to 70 degC, 8-pin DIP (P8), Pb-Free (RoHS); Manufacturer: Texas Instruments; Total Supply Voltage(Min)(+5V is 5, +/-5V is 10): 7; Iq per channel(Max)(mA): 2.5; GBW(Typ)(MHz): 3; Vio (25C)(Max)(mV): 10; CMRR(Min)(dB): 70; Rating: Military; Vn at 1kHz(Typ)(nV/rtHz): 18; IIB(Max)(pA): 200; Number of Channels: 1; Sub Family: General Purpose Amplifier, High Supply Voltage Amplifier (>=30V); Total Supply Voltage(Max)(+5V is 5, +/-5V is 10): 36; Slew Rate(Typ)(V/us): 13; ComponentLink1Description: Manufacturer URL; PackageReference: P0008A; ComponentLink3Description: Package Specification; ComponentLink3URL: http://www.ti.com/litv/pdf/mpdi001b; Mounting Technology: Through Hole; ComponentLink2Description: Datasheet; ComponentLink2URL: http://www.ti.com/lit/ds/symlink/tl071.pdf; PartNumber: TL071CP; Eco-Plan: Pb-Free (RoHS); Offset Drift(Typ)(uV/C): 18; Code_JEDEC: MS-001; DatasheetVersion: SLOS080J; PackageVersion: 4040082/E, 04/2010; PackageDescription: 8-Pin Plastic In-Line, Body 9.59 x 6.35 mm, Pitch 2.54 mm; ComponentLink1URL: http://www.ti.com/
U2-U4 = CMP-0017-00950-2: Dual Low-Noise JFET-Input General-Purpose Operational Amplifier, 7 to 36 V, 0 to 70 degC, 8-pin DIP (P8), Pb-Free (RoHS); Manufacturer: Texas Instruments; Sub Family: General Purpose Amplifier, High Supply Voltage Amplifier (>=30V); Total Supply Voltage(Max)(+5V is 5, +/-5V is 10): 36; Slew Rate(Typ)(V/us): 13; Vn at 1kHz(Typ)(nV/rtHz): 18; GBW(Typ)(MHz): 3; CMRR(Min)(dB): 70; Total Supply Voltage(Min)(+5V is 5, +/-5V is 10): 7; Vio (25C)(Max)(mV): 10; Rating: Catalog; IIB(Max)(pA): 200; Iq per channel(Max)(mA): 2.5; Number of Channels: 2; Mounting Technology: Through Hole; ComponentLink3Description: Package Specification; PartNumber: TL072CP; PackageVersion: 4040082/E, 04/2010; Eco-Plan: Pb-Free (RoHS); DatasheetVersion: SLOS080J; Offset Drift(Typ)(uV/C): 18; ComponentLink3URL: http://www.ti.com/litv/pdf/mpdi001b; PackageDescription: 8-Pin Plastic In-Line, Body 9.59 x 6.35 mm, Pitch 2.54 mm; Code_JEDEC: MS-001; ComponentLink2URL: http://www.ti.com/lit/ds/symlink/tl072.pdf; ComponentLink1Description: Manufacturer URL; ComponentLink2Description: Datasheet; ComponentLink1URL: http://www.ti.com/; PackageReference: P0008A